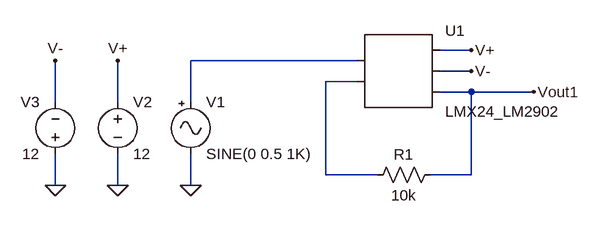
[diagram p0: schematic LM324M.asc]
LM324M.asc, the LTspice schematic file:
Version 4
SHEET 1 880 680
WIRE 240 224 192 224
WIRE 64 240 -192 240
WIRE 240 256 192 256
WIRE 64 272 16 272
WIRE 240 288 192 288
WIRE 336 288 240 288
WIRE -400 304 -400 240
WIRE -304 304 -304 240
WIRE -192 304 -192 240
WIRE 16 416 16 272
WIRE 96 416 16 416
WIRE 240 416 240 288
WIRE 240 416 176 416
WIRE -400 432 -400 384
WIRE -304 432 -304 384
WIRE -192 432 -192 384
FLAG -192 432 0
FLAG 336 288 Vout1
FLAG 240 224 V+
FLAG 240 256 V-
FLAG -304 432 0
FLAG -400 432 0
FLAG -400 240 V-
FLAG -304 240 V+
SYMBOL Misc\\signal -192 288 R0
WINDOW 123 0 0 Left 0
WINDOW 39 0 0 Left 0
SYMATTR InstName V1
SYMATTR Value SINE(0 0.5 1K)
SYMBOL AutoGenerated\\LMX24_LM2902 128 256 R0
SYMATTR InstName U1
SYMBOL res 192 400 R90
WINDOW 0 0 56 VBottom 2
WINDOW 3 32 56 VTop 2
SYMATTR InstName R1
SYMATTR Value 10k
SYMBOL voltage -304 288 R0
WINDOW 123 0 0 Left 0
WINDOW 39 0 0 Left 0
SYMATTR InstName V2
SYMATTR Value 12
SYMBOL voltage -400 400 R180
WINDOW 0 24 96 Left 2
WINDOW 3 24 16 Left 2
WINDOW 123 0 0 Left 0
WINDOW 39 0 0 Left 0
SYMATTR InstName V3
SYMATTR Value 12

The netlist it stands for:
* LM324M.asc
V1 N001 0 SINE(0 0.5 1K)
* U1: LMX24_LM2902 (symbol AutoGenerated\LMX24_LM2902 not available, pins judged from their places): pin1=N001 pin2=N002 pin3=V+ pin4=V- pin5=Vout1
R1 Vout1 N002 10k
V2 V+ 0 12
V3 0 V- 12
.backanno
.end